# EAGLE design Bench_Controller (EAGLE 9.6.2)
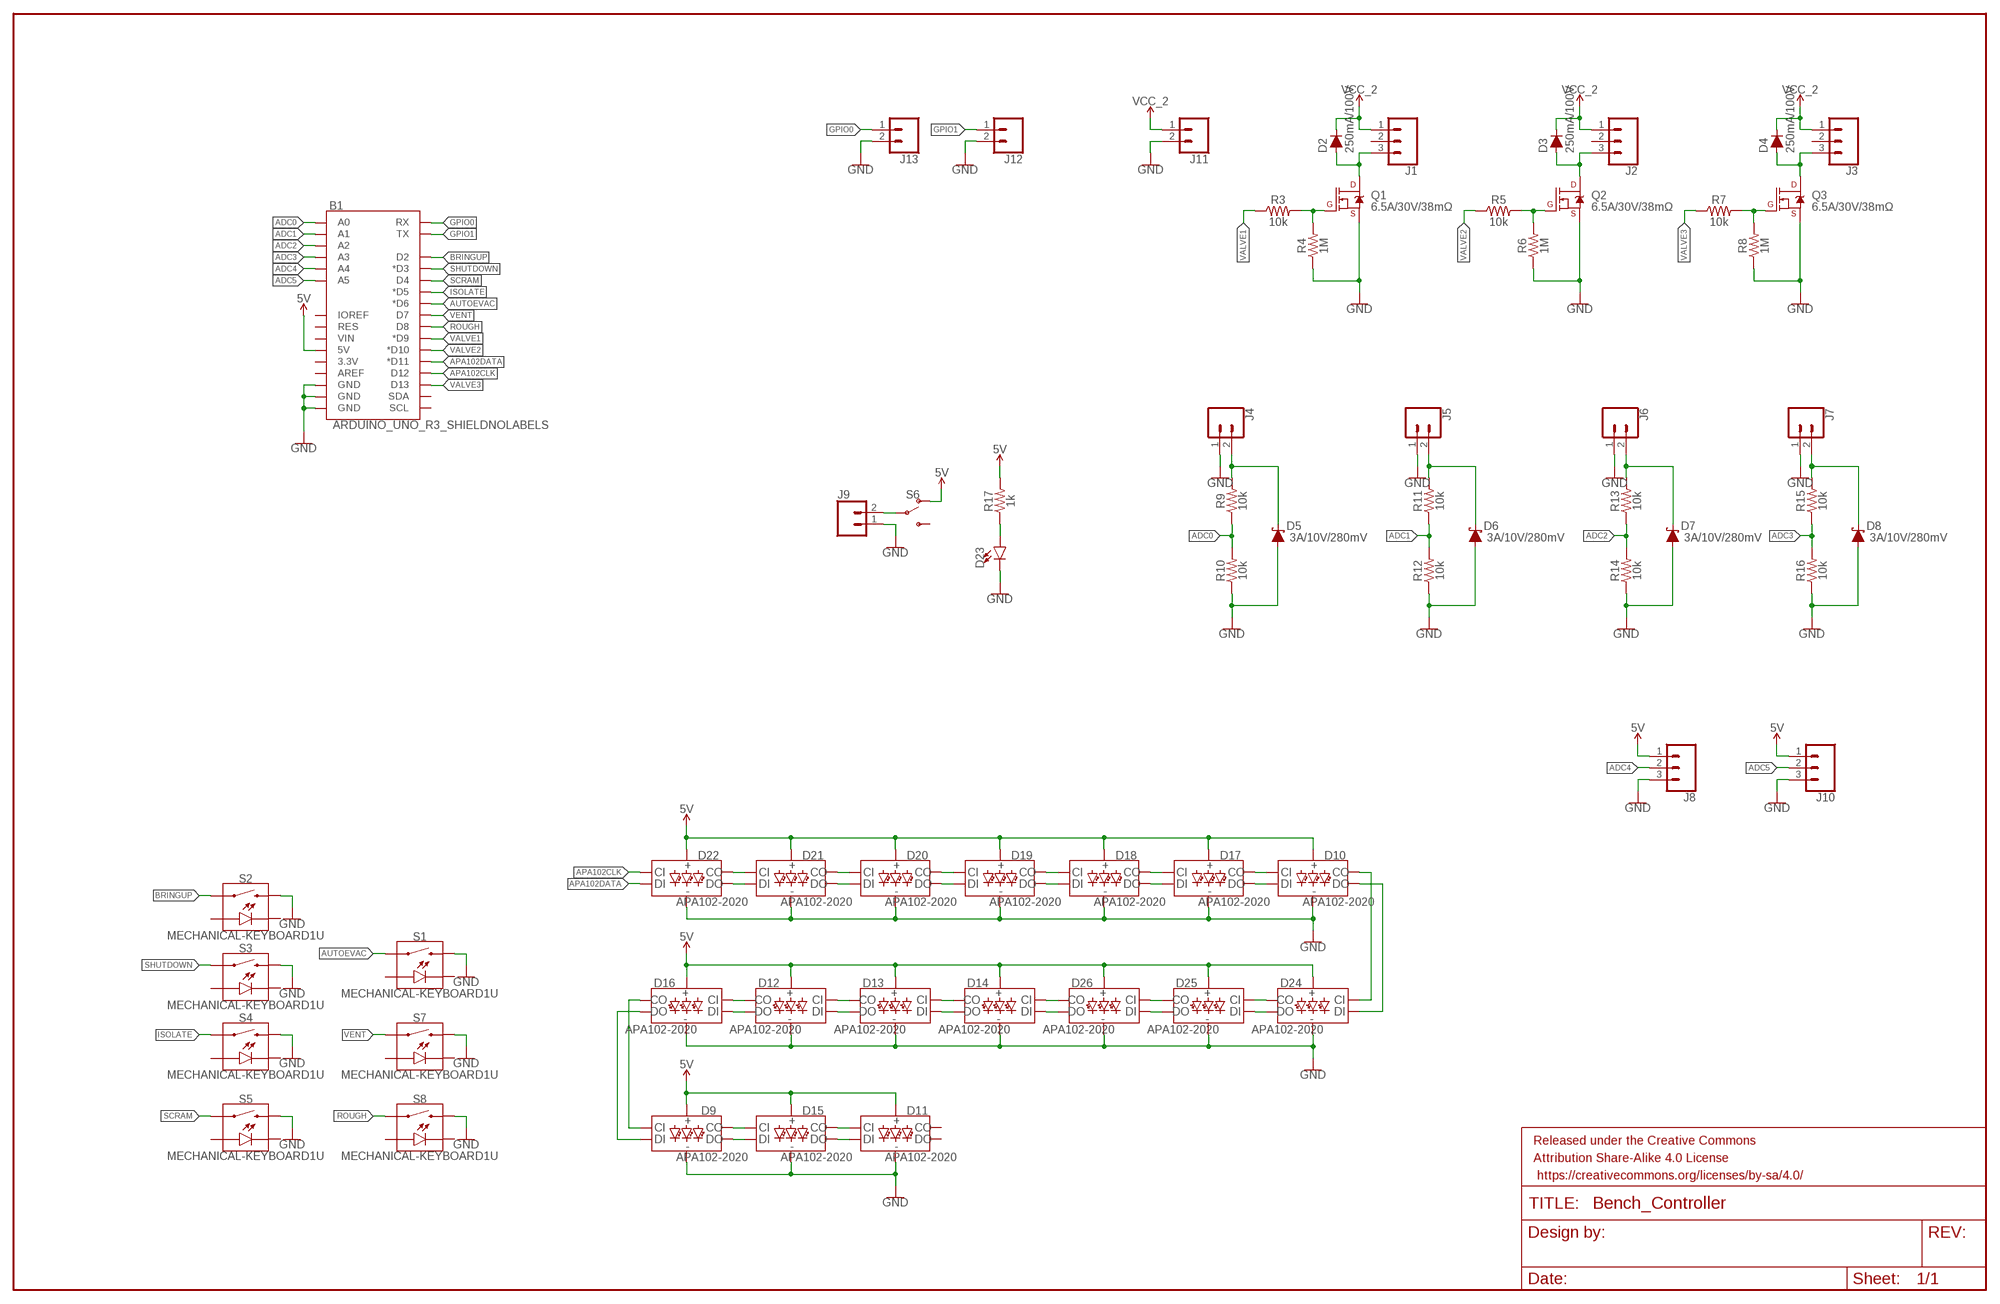
[diagram p0: schematic, sheet 1]

## Parts
B1  ARDUINO_UNO_R3_SHIELDNOLABELS  [UNO_R3_SHIELD_NOLABELS]
D2  250mA/100V  DIODE-BAS16J  [SOD-323]
D3  250mA/100V  DIODE-BAS16J  [SOD-323]
D4  250mA/100V  DIODE-BAS16J  [SOD-323]
D5  3A/10V/280mV  DIODE-SCHOTTKY-BAT60A  [SOD-323]
D6  3A/10V/280mV  DIODE-SCHOTTKY-BAT60A  [SOD-323]
D7  3A/10V/280mV  DIODE-SCHOTTKY-BAT60A  [SOD-323]
D8  3A/10V/280mV  DIODE-SCHOTTKY-BAT60A  [SOD-323]
D9  APA102-2020  [APA102-2020]
D10  APA102-2020  [APA102-2020]
D11  APA102-2020  [APA102-2020]
D12  APA102-2020  [APA102-2020]
D13  APA102-2020  [APA102-2020]
D14  APA102-2020  [APA102-2020]
D15  APA102-2020  [APA102-2020]
D16  APA102-2020  [APA102-2020]
D17  APA102-2020  [APA102-2020]
D18  APA102-2020  [APA102-2020]
D19  APA102-2020  [APA102-2020]
D20  APA102-2020  [APA102-2020]
D21  APA102-2020  [APA102-2020]
D22  APA102-2020  [APA102-2020]
D23  LED5MM  [LED_5MM]
D24  APA102-2020  [APA102-2020]
D25  APA102-2020  [APA102-2020]
D26  APA102-2020  [APA102-2020]
FRAME1  FRAME-LEDGER  [CREATIVE_COMMONS]
J1  CONN_031X03_NO_SILK  [1X03_NO_SILK]
J2  CONN_031X03_NO_SILK  [1X03_NO_SILK]
J3  CONN_031X03_NO_SILK  [1X03_NO_SILK]
J4  CONN_021X02_NO_SILK  [1X02_NO_SILK]
J5  CONN_021X02_NO_SILK  [1X02_NO_SILK]
J6  CONN_021X02_NO_SILK  [1X02_NO_SILK]
J7  CONN_021X02_NO_SILK  [1X02_NO_SILK]
J8  CONN_031X03_NO_SILK  [1X03_NO_SILK]
J9  CONN_021X02_NO_SILK  [1X02_NO_SILK]
J10  CONN_031X03_NO_SILK  [1X03_NO_SILK]
J11  CONN_021X02_NO_SILK  [1X02_NO_SILK]
J12  CONN_021X02_NO_SILK  [1X02_NO_SILK]
J13  CONN_021X02_NO_SILK  [1X02_NO_SILK]
Q1  6.5A/30V/38mΩ  MOSFET-NCH-FDS6630A  [SO08]
Q2  6.5A/30V/38mΩ  MOSFET-NCH-FDS6630A  [SO08]
Q3  6.5A/30V/38mΩ  MOSFET-NCH-FDS6630A  [SO08]
R3  10k  10KOHM-0603-1/10W-1%  [0603]
R4  1M  1MOHM-0603-1/4W-5%  [0603]
R5  10k  10KOHM-0603-1/10W-1%  [0603]
R6  1M  1MOHM-0603-1/4W-5%  [0603]
R7  10k  10KOHM-0603-1/10W-1%  [0603]
R8  1M  1MOHM-0603-1/4W-5%  [0603]
R9  10k  10KOHM-0603-1/10W-1%  [0603]
R10  10k  10KOHM-0603-1/10W-1%  [0603]
R11  10k  10KOHM-0603-1/10W-1%  [0603]
R12  10k  10KOHM-0603-1/10W-1%  [0603]
R13  10k  10KOHM-0603-1/10W-1%  [0603]
R14  10k  10KOHM-0603-1/10W-1%  [0603]
R15  10k  10KOHM-0603-1/10W-1%  [0603]
R16  10k  10KOHM-0603-1/10W-1%  [0603]
R17  1k  1KOHM-0603-1/10W-1%  [0603]
S1  MECHANICAL-KEYBOARD1U  [CHERRY-MX-LED-1U]
S2  MECHANICAL-KEYBOARD1U  [CHERRY-MX-LED-1U]
S3  MECHANICAL-KEYBOARD1U  [CHERRY-MX-LED-1U]
S4  MECHANICAL-KEYBOARD1U  [CHERRY-MX-LED-1U]
S5  MECHANICAL-KEYBOARD1U  [CHERRY-MX-LED-1U]
S6  SWITCH-SPDT-PTH-11.6X4.0MM  [SWITCH_SPDT_PTH_11.6X4.0MM]
S7  MECHANICAL-KEYBOARD1U  [CHERRY-MX-LED-1U]
S8  MECHANICAL-KEYBOARD1U  [CHERRY-MX-LED-1U]

## Nets
5V: B1.5V D9.VDD(VCC) D10.VDD(VCC) D11.VDD(VCC) D12.VDD(VCC) D13.VDD(VCC) D14.VDD(VCC) D15.VDD(VCC) D16.VDD(VCC) D17.VDD(VCC) D18.VDD(VCC) D19.VDD(VCC) D20.VDD(VCC) D21.VDD(VCC) D22.VDD(VCC) D24.VDD(VCC) D25.VDD(VCC) D26.VDD(VCC) J8.1 J10.1 R17.2 S6.1(O)
ADC0: B1.A0 R9.1 R10.2
ADC1: B1.A1 R11.1 R12.2
ADC2: B1.A2 R13.1 R14.2
ADC3: B1.A3 R15.1 R16.2
ADC4: B1.A4 J8.2
ADC5: B1.A5 J10.2
ANALOG_IN_0: D5.C J4.2 R9.2
ANALOG_IN_1: D6.C J5.2 R11.2
ANALOG_IN_2: D7.C J6.2 R13.2
ANALOG_IN_3: D8.C J7.2 R15.2
APA102CLK: B1.D12 D22.CKI(CI)
APA102DATA: B1.D11(*D11) D22.SDI(DI)
AUTOEVAC: B1.D6(*D6) S1.S1
BRINGUP: B1.D2 S2.S1
GND: B1.GND@0(GND) B1.GND@1(GND) B1.GND@2(GND) D5.A D6.A D7.A D8.A D9.GND D10.GND D11.GND D12.GND D13.GND D14.GND D15.GND D16.GND D17.GND D18.GND D19.GND D20.GND D21.GND D22.GND D23.K(C) D24.GND D25.GND D26.GND J4.1 J5.1 J6.1 J7.1 J8.3 J9.1 J10.3 J11.2 J12.2 J13.2 Q1.1(S) Q1.2(S) Q1.3(S) Q2.1(S) Q2.2(S) Q2.3(S) Q3.1(S) Q3.2(S) Q3.3(S) R4.1 R6.1 R8.1 R10.1 R12.1 R14.1 R16.1 S1.S2 S2.S2 S3.S2 S4.S2 S5.S2 S7.S2 S8.S2
GPIO0: B1.RX J13.1
GPIO1: B1.TX J12.1
ISOLATE: B1.D5(*D5) S4.S1
N$2: Q1.4(G) R3.2 R4.2
N$4: Q2.4(G) R5.2 R6.2
N$5: D2.A J1.3 Q1.5(D) Q1.6(D) Q1.7(D) Q1.8(D)
N$6: D3.A J2.3 Q2.5(D) Q2.6(D) Q2.7(D) Q2.8(D)
N$7: Q3.4(G) R7.2 R8.2
N$8: D4.A J3.3 Q3.5(D) Q3.6(D) Q3.7(D) Q3.8(D)
N$9: D21.CKI(CI) D22.CKO(CO)
N$10: J9.2 S6.2(P)
N$11: D23.A R17.1
N$12: D21.SDI(DI) D22.SDO(DO)
N$13: D20.CKI(CI) D21.CKO(CO)
N$14: D20.SDI(DI) D21.SDO(DO)
N$15: D19.CKI(CI) D20.CKO(CO)
N$16: D19.SDI(DI) D20.SDO(DO)
N$17: D18.CKI(CI) D19.CKO(CO)
N$18: D18.SDI(DI) D19.SDO(DO)
N$19: D17.CKI(CI) D18.CKO(CO)
N$20: D17.SDI(DI) D18.SDO(DO)
N$21: D10.CKI(CI) D17.CKO(CO)
N$22: D10.SDI(DI) D17.SDO(DO)
N$23: D10.CKO(CO) D24.CKI(CI)
N$25: D10.SDO(DO) D24.SDI(DI)
N$26: D24.CKO(CO) D25.CKI(CI)
N$27: D24.SDO(DO) D25.SDI(DI)
N$28: D25.CKO(CO) D26.CKI(CI)
N$29: D25.SDO(DO) D26.SDI(DI)
N$30: D14.CKI(CI) D26.CKO(CO)
N$31: D14.SDI(DI) D26.SDO(DO)
N$32: D13.CKI(CI) D14.CKO(CO)
N$33: D13.SDI(DI) D14.SDO(DO)
N$34: D12.CKI(CI) D13.CKO(CO)
N$35: D12.SDI(DI) D13.SDO(DO)
N$36: D12.CKO(CO) D16.CKI(CI)
N$37: D12.SDO(DO) D16.SDI(DI)
N$38: D9.CKI(CI) D16.CKO(CO)
N$39: D9.SDI(DI) D16.SDO(DO)
N$40: D9.CKO(CO) D15.CKI(CI)
N$41: D9.SDO(DO) D15.SDI(DI)
N$42: D11.CKI(CI) D15.CKO(CO)
N$43: D11.SDI(DI) D15.SDO(DO)
ROUGH: B1.D8 S8.S1
SCRAM: B1.D4 S5.S1
SHUTDOWN: B1.D3(*D3) S3.S1
VALVE1: B1.D9(*D9) R3.1
VALVE2: B1.D10(*D10) R5.1
VALVE3: B1.D13 R7.1
VCC_2: D2.C D3.C D4.C J1.1 J2.1 J3.1 J11.1
VENT: B1.D7 S7.S1
Unconnected: B1.3.3V B1.AREF B1.IOREF B1.RES B1.SCL B1.SDA B1.VIN D11.CKO(CO) D11.SDO(DO) J1.2 J2.2 J3.2 S1.A S1.K(C) S2.A S2.K(C) S3.A S3.K(C) S4.A S4.K(C) S5.A S5.K(C) S6.3(S) S7.A S7.K(C) S8.A S8.K(C)

## Library data of the parts
B1 = SparkFun-Boards:ARDUINO_UNO_R3_SHIELD: Arduino R3 Shield Footprint Shield form compatible with the Arduino Uno R3. SparkFun Products: MG2639 Cellular Shield <https://www.sparkfun.com/products/13120> MIDI Shield <https://www.sparkfun.com/products/12898> R3 Stackable Headers Kit <https://www.sparkfun.com/products/11417>
D2-D4 = SparkFun-DiscreteSemi:DIODE: Diode These are standard reverse protection diodes and small signal diodes. SparkFun Products: SparkFun SparkPunk Sound Kit <https://www.sparkfun.com/products/11177> SparkFun ESP8266 Thing <https://www.sparkfun.com/products/13231>; PROD_ID: DIO-09646
D5-D8 = SparkFun-DiscreteSemi:DIODE-SCHOTTKY: Schottky diode A Schottky diode is a semiconductor diode which has a low forward voltage drop and a very fast switching action.; PROD_ID: DIO-14072
D9-D22 D24-D26 = SparkFun-LED:APA102: Addressable RGB LED - 2 Wire Common names: APA102, Dotstar, etc. Packages: 5050 2020 SparkFun Products: SparkFun Lumenati Boards <https://www.sparkfun.com/categories/405>; PROD_ID: DIO-14111
D23 = SparkFun-LED:LED: LED (Generic) Standard schematic elements and footprints for 5mm, 3mm, 1206, and 0603 sized LEDs. Generic LEDs with no color specified.
FRAME1 = SparkFun-Aesthetics:FRAME-LEDGER: Schematic Frame - Ledger Standard 11x14 US Ledger frame
J1-J3 J8 J10 = SparkFun-Connectors:CONN_03: Multi connection point. Often used as Generic Header-pin footprint for 0.1 inch spaced/style header connections On any of the 0.1 inch spaced packages, you can populate with these: Break Away Headers - Straight <https://www.sparkfun.com/products/116> (PRT-00116) Break Away Male Headers - Right Angle <https://www.sparkfun.com/products/553> (PRT-00553) Female Headers <https://www.sparkfun.com/products/115> (PRT-00115) Break Away Headers - Machine Pin <https://www.sparkfun.com/products/117> (PRT-00117) Break Away Female Headers - Swiss Machine Pin <https://www.sparkfun.com/products/743> (PRT-00743) Stackable Header - 3 Pin (Female, 0.1") <https://www.sparkfun.com/products/13875> (PRT-13875) For SCREWTERMINALS and SPRING TERMINALS visit here: Screw Terimnals on SparkFun.com <https://www.sparkfun.com/search/results?term=Screw+Terminals> (5mm/3.5mm/2.54mm spacing) This device is also useful as a general connection point to wire up your design to another part of your project. Our various solder wires solder well into these plated through hole pads. Hook-Up Wire - Assortment (Stranded, 22 AWG) <https://www.sparkfun.com/products/11375> (PRT-11375) Hook-Up Wire - Assortment (Solid Core, 22 AWG) <https://www.sparkfun.com/products/11367> (PRT-11367) View the entire wire category on our website here <https://www.sparkfun.com/categories/141> Special notes: Molex polarized connector foot print use with SKU : PRT-08232 with associated crimp pins and housings.
J4-J7 J9 J11-J13 = SparkFun-Connectors:CONN_02: Multi connection point. Often used as Generic Header-pin footprint for 0.1 inch spaced/style header connections On any of the 0.1 inch spaced packages, you can populate with these: Break Away Headers - Straight <https://www.sparkfun.com/products/116> (PRT-00116) Break Away Male Headers - Right Angle <https://www.sparkfun.com/products/553> (PRT-00553) Female Headers <https://www.sparkfun.com/products/115> (PRT-00115) Break Away Headers - Machine Pin <https://www.sparkfun.com/products/117> (PRT-00117) Break Away Female Headers - Swiss Machine Pin <https://www.sparkfun.com/products/743> (PRT-00743) For SCREWTERMINALS and SPRING TERMINALS visit here: Screw Terimnals on SparkFun.com <https://www.sparkfun.com/search/results?term=Screw+Terminals> (5mm/3.5mm/2.54mm spacing) This device is also useful as a general connection point to wire up your design to another part of your project. Our various solder wires solder well into these plated through hole pads. Hook-Up Wire - Assortment (Stranded, 22 AWG) <https://www.sparkfun.com/products/11375> (PRT-11375) Hook-Up Wire - Assortment (Solid Core, 22 AWG) <https://www.sparkfun.com/products/11367> (PRT-11367) View the entire wire category on our website here <https://www.sparkfun.com/categories/141> Special notes: Molex polarized connector foot print use with: PRT-08233 with associated crimp pins and housings. 2.54_SCREWTERM for use with PRT-10571. 3.5mm Screw Terminal footprints for PRT-08084 5mm Screw Terminal footprints for use with PRT-08432
Q1-Q3 = SparkFun-DiscreteSemi:MOSFET-NCH: N-channel MOSFETs Voltage controlled devices that allow control of high current outputs. SparkFun Products: SparkFun OpenScale <https://www.sparkfun.com/products/13261> SparkFun Digital Sandbox <https://www.sparkfun.com/products/12651> SparkFun Monster Moto Shield <https://www.sparkfun.com/products/10182> SparkFun MOSFET Power Controller <https://www.sparkfun.com/products/11214>; PROD_ID: TRANS-08089
R3 R5 R7 R9-R16 = SparkFun-Resistors:10KOHM: 10kΩ resistor A resistor is a passive two-terminal electrical component that implements electrical resistance as a circuit element. Resistors act to reduce current flow, and, at the same time, act to lower voltage levels within circuits. - Wikipedia; PROD_ID: RES-00824
R4 R6 R8 = SparkFun-Resistors:1MOHM: 1MΩ resistor A resistor is a passive two-terminal electrical component that implements electrical resistance as a circuit element. Resistors act to reduce current flow, and, at the same time, act to lower voltage levels within circuits. - Wikipedia; PROD_ID: RES-07868
R17 = SparkFun-Resistors:1KOHM: 1kΩ resistor A resistor is a passive two-terminal electrical component that implements electrical resistance as a circuit element. Resistors act to reduce current flow, and, at the same time, act to lower voltage levels within circuits. - Wikipedia; PROD_ID: RES-07856
S1-S5 S7 S8 = SparkFun-Switches:MECHANICAL-KEYBOARD: Mechanical Keyboard Spacings for Cherry-MX Cherry-MX w/ LED switch footprints. Each package variant contains a bounding box on the tDocu layer for proper key spacing and a dimensional drawing on the Reference layer to be exported for laser cut mounting plates. Footprints are off-center so that the origin lies on the lower left corner of the key-spacing. This allows for most common layouts to be easily acheived on a grid spacing of 0.1875" Variants 1U through 1.75U in .25U steps Centered switch cutout in SwitchPlate layer with no stabilizers 2U through 2.75U in .25U steps Centered switch cutout in SwitchPlate layer with Cherry+Costar stabilizer holes 6.25U Common spacebar size Centered switch cutout in SwitchPlate layer with Cherry+Costar stabilizer holes "Big Ass" Enter ANSI 104 "Big Ass" Enter Key layout ISO Enter ISO style Enter Key layout
S6 = SparkFun-Switches:SWITCH-SPDT: Single Pole, Double Throw (SPDT) Switch Single-pole, double-throw (SPDT) switch. Variant Overview SMD-AYZ0202 Surface Mount DPDT Switch <https://www.sparkfun.com/products/597> (COM-00597) Used on e.g. LilyPad Arduino USB - ATmega32U4 Board <https://www.sparkfun.com/products/12049> PTH-11.6X4.0MM SPDT Mini Power Switch <https://www.sparkfun.com/products/102> (COM-00102) Used on e.g. SparkFun Simon Says - Through-Hole Soldering Kit <https://www.sparkfun.com/products/10547> (KIT-10547) PTH-11.6X4.0MM-KIT KIT version of SPDT Mini Power Switch - Simplifies soldering by removing tStop of switch pins - only one side can be soldered. PTH-11.6X4.0MM-LOCK LOCK version of SPDT Mini Power Switch - Offset pins hold switch in place for easier soldering. SMD-RIGHT-ANGLE Surface Mount Right Angle Switch <https://www.sparkfun.com/products/10860> (COM-10860) Used on e.g. SparkFun ESP8266 Thing <https://www.sparkfun.com/products/13231>; PROD_ID: SWCH-08261; SF_SKU: COM-00102

## Board
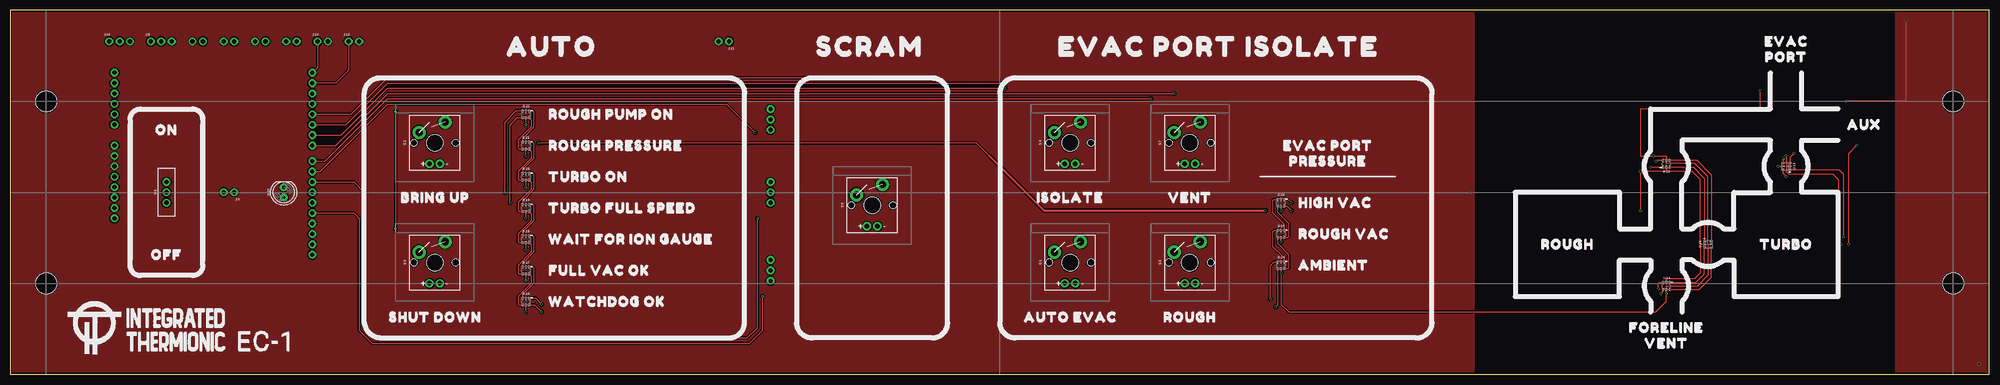
[diagram p1: board, top side]
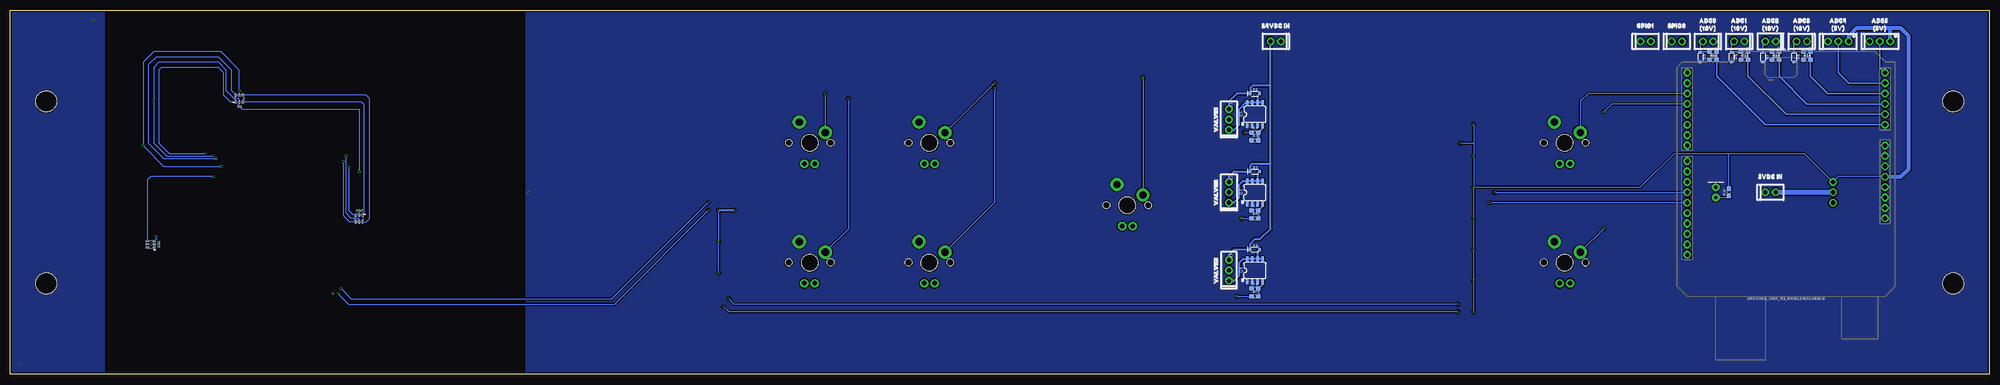
[diagram p2: board, bottom side, seen from below]

Size 482.6 x 88.9 mm. Coordinates in mm from the lower left corner, seen from the top.
Outline: 0,0 482.6,0 482.6,88.9 0,88.9 0,0
Copper layers (1*16): Top 0.035mm / dielectric 1.5mm / Bottom 0.035mm
Design rules "SparkFun-2-Layer-Minimum-JLCPCB": minimum track width 5mil, minimum drill 0.3mm, track to track 5mil, track to pad 5mil, pad to pad 5mil, via to via 5mil, smd to smd 5mil, copper to edge 7mil, drill to drill 7mil, minimum pad ring 5mil, minimum via ring 5mil, stop-mask expansion 4mil, vias tented up to drill 25mil, thermal gap 10mil
Holes 5.08 mm at 8.76,66.67 8.76,22.23 473.84,66.67 473.84,22.23

### Footprints (pad centres in the part's own frame; a part is rotated, then mirrored left to right if it is on the bottom)
UNO_R3_SHIELD_NOLABELS = drill 1.016 pad 1.88: 3.3V 24.13,-3.81; 5V 24.13,-1.27; A0 24.13,11.43; A1 24.13,13.97; A2 24.13,16.51; A3 24.13,19.05; A4 24.13,21.59; A5 24.13,24.13; AREF -24.13,-15.24; D2 -24.13,19.05; D3 -24.13,16.51; D4 -24.13,13.97; D5 -24.13,11.43; D6 -24.13,8.89; D7 -24.13,6.35; D8 -24.13,2.54; D9 -24.13,0; D10 -24.13,-2.54; D11 -24.13,-5.08; D12 -24.13,-7.62; D13 -24.13,-10.16; GND@0 24.13,1.27; GND@1 24.13,3.81; GND@2 -24.13,-12.7; IOREF 24.13,-8.89; NC 24.13,-11.43; RES 24.13,-6.35; RX -24.13,24.13; SCL -24.13,-20.32; SDA -24.13,-17.78; TX -24.13,21.59; VIN 24.13,6.35
SOD-323 = smd 0.63 x 0.83: A 1.15,0; C -1.15,0
APA102-2020 = smd 0.4 x 0.7: CKI -0.8,-0.85; CKO 0.8,-0.85; GND 0,0.85; SDI -0.8,0.85; SDO 0.8,0.85; VDD 0,-0.85
LED_5MM = drill 0.813 pad 1.88: A -1.27,0; K 1.27,0
1X03_NO_SILK = drill 1.016 pad 1.88: 1 0,0; 2 2.54,0; 3 5.08,0
1X02_NO_SILK = drill 1.016 pad 1.88: 1 0,0; 2 2.54,0
SO08 = smd 0.6 x 1.2: 1 -1.905,-2.8; 2 -0.635,-2.8; 3 0.635,-2.8; 4 1.905,-2.8; 5 1.905,2.8; 6 0.635,2.8; 7 -0.635,2.8; 8 -1.905,2.8
0603 = smd 1.1 x 1: 1 -0.85,0; 2 0.85,0
CHERRY-MX-LED-1U = drill 1.092 pad 2.032: A 8.255,4.445; K 10.795,4.445 | drill 1.753 pad 3.226: S1 5.715,12.065; S2 12.065,14.605 | hole 4.089: 9.525,9.525 | hole 1.707: 4.445,9.525; 14.605,9.525
SWITCH_SPDT_PTH_11.6X4.0MM = drill 1.016 pad 1.88: 1 0,2.54; 2 0,0; 3 0,-2.54

### Placement (x,y rotation side)
B1  49.53,49.53 0 bottom
D2  179.07,68.58 0 bottom
D3  179.07,49.53 0 bottom
D4  179.07,30.48 0 bottom
D5  70.48,77.47 270 bottom
D6  62.87,77.47 270 bottom
D7  55.24,77.47 270 bottom
D8  47.62,77.47 270 bottom
D9  426.72,67.31 180 bottom
D10  125.73,17.78 0 top
D11  448.31,31.75 270 bottom
D12  403.86,51.44 180 top
D13  414.02,31.75 90 top
D14  403.86,21.59 0 top
D15  433.07,50.8 270 top
D16  397.51,38.1 0 bottom
D17  125.73,25.4 0 top
D18  125.73,33.02 0 top
D19  125.73,40.64 0 top
D20  125.73,48.26 0 top
D21  125.73,55.88 0 top
D22  125.73,63.5 0 top
D23  66.67,44.45 90 top
D24  309.88,26.67 0 top
D25  309.88,34.29 0 top
D26  309.88,41.91 0 top
FRAME1  21.59,-8.89 0 top  (outside the outline)
J1  185.42,64.77 270 bottom
J2  185.42,46.99 270 bottom
J3  185.42,27.94 270 bottom
J4  67.31,81.28 180 bottom
J5  59.69,81.28 180 bottom
J6  52.07,81.28 180 bottom
J7  44.45,81.28 180 bottom
J8  34.29,81.28 0 top
J9  54.61,44.45 180 top
J10  24.13,81.28 0 top
J11  175.26,81.28 180 top
J12  82.55,81.28 0 top
J13  74.93,81.28 0 top
Q1  179.07,63.5 0 bottom
Q2  179.07,44.45 0 bottom
Q3  179.07,25.4 0 bottom
R3  179.07,59.05 0 bottom
R4  179.07,57.15 0 bottom
R5  179.07,38.1 0 bottom
R6  179.07,40.01 0 bottom
R7  179.07,19.05 0 bottom
R8  179.07,20.95 0 bottom
R9  67.31,78.74 180 bottom
R10  67.31,76.83 0 bottom
R11  59.69,78.74 180 bottom
R12  59.69,76.83 0 bottom
R13  52.07,78.74 180 bottom
R14  52.07,76.83 0 bottom
R15  44.45,78.74 180 bottom
R16  44.45,76.83 0 bottom
R17  63.5,44.45 90 bottom
S1  248.92,17.78 0 top
S2  93.98,46.99 0 top
S3  93.98,17.78 0 top
S4  248.92,46.99 0 top
S5  200.66,31.75 0 top
S6  38.1,44.45 0 top
S7  278.13,46.99 0 top
S8  278.13,17.78 0 top
U$1  [ROUGH0]  379.73,31.75 0 top
U$2  [TURBO0]  433.07,31.75 0 top
U$3  [FORELINE0]  403.86,11.43 0 top
U$4  [VENT0]  403.86,7.62 0 top
U$5  [EVAC0]  433.07,81.28 0 top
U$6  [PORT0]  433.07,77.47 0 top
U$7  [AUX0]  452.12,60.96 0 top
U$8  [ON0]  38.1,59.69 0 top
U$9  [OFF0]  38.1,29.21 0 top
U$10  [AUTO0]  132.08,80.01 0 top
U$11  [BRING_UP0]  103.63,43.18 0 top
U$12  [SHUT_DOWN0]  103.63,13.97 0 top
U$13  [SCRAM0]  209.55,80.01 0 top
U$14  [EVAC_PORT_ISOLATE0]  294.64,80.01 0 top
U$15  [FULL_VAC_OK0]  129.54,25.4 0 top
U$16  [ROUGH_PRESSURE0]  129.54,55.88 0 top
U$17  [TURBO_ON0]  129.54,48.26 0 top
U$18  [ROUGH_PUMP_ON0]  129.54,63.5 0 top
U$19  [TURBO_FULL_SPEED0]  129.54,40.64 0 top
U$20  [WATCHDOG_OK0]  129.54,17.78 0 top
U$21  [WAIT_FOR_ION_GAUGE0]  129.54,33.02 0 top
U$22  [ISOLATE0]  258.44,43.18 0 top
U$23  [AUTO_EVAC0]  258.57,13.97 0 top
U$24  [VENT0]  287.65,43.18 0 top
U$25  [ROUGH0]  287.65,13.97 0 top
U$26  [EVAC_PORT0]  321.31,55.88 0 top
U$27  [PRESSURE0]  321.31,52.07 0 top
U$28  [HIGH_VAC0]  312.42,41.91 0 top
U$29  [ROUGH_VAC0]  312.42,34.29 0 top
U$30  [AMBIENT0]  312.42,26.67 0 top
U$31  [ADC50]  26.67,86.36 0 bottom
U$32  [ADC40]  36.83,86.36 0 bottom
U$33  [ADC30]  45.72,86.36 0 bottom
U$34  [ADC20]  53.34,86.36 0 bottom
U$35  [ADC10]  60.96,86.36 0 bottom
U$36  [ADC00]  68.58,86.36 0 bottom
U$37  [GPIO00]  76.2,85.09 0 bottom
U$38  [GPIO10]  83.82,85.09 0 bottom
U$39  [5VDC_IN0]  53.34,48.26 0 bottom
U$40  [_##5V##_0]  26.67,84.45 0 bottom
U$41  [_##5V##_0]  36.83,84.45 0 bottom
U$42  [_##10V##_0]  45.72,84.45 0 bottom
U$43  [_##10V##_0]  53.34,84.45 0 bottom
U$44  [_##10V##_0]  60.96,84.45 0 bottom
U$45  [_##10V##_0]  68.58,84.45 0 bottom
U$46  [24VDC_IN0]  173.99,85.09 0 bottom
U$47  [VALVE10]  188.59,62.23 90 bottom
U$48  [VALVE20]  188.59,44.45 90 bottom
U$49  [VALVE30]  188.59,25.4 90 bottom
U$50  [INTEG#SVG0]  -40.01,43.18 0 top  (outside the outline)
U$51  [EC#10]  51.69,8.13 0 top

### Tracks (layer width: path | path; a pad name or v marks a point on that pad's centre or on a via)
5V  (via drill 0.3, 0.35, 0.38)
  Top 0.203: D22.VDD v125.73,60.96 | v125.73,53.34 D21.VDD | D20.VDD v125.73,45.72 | D19.VDD v125.73,38.1 | D18.VDD v125.73,30.48 | D17.VDD v125.73,22.86 | D10.VDD v125.73,15.24 | D26.VDD v309.88,40.01 | v309.88,32.38 D25.VDD | D24.VDD v309.88,24.77 309.88,17.14 311.79,15.24 401.32,15.24 403.86,17.78 v403.86,19.68 D14.VDD 403.86,21.59 411.48,21.59 414.02,24.13 414.02,31.75 | D13.VDD 414.02,31.75 | 414.02,31.75 414.02,48.26 410.85,51.44 403.86,51.44 D12.VDD 403.86,53.34 v400.69,53.34 397.51,53.34 397.51,64.77 426.08,64.77 426.72,65.41 v426.72,69.22 | v431.17,50.8 D15.VDD | v448.31,31.75 448.31,53.98 v450.21,55.88 | 238.76,53.34 235.59,56.52 v128.91,56.52
  Top 0.508: 238.76,53.34 252.09,40.01 v306.07,40.01
  Bottom 0.203: v125.73,60.96 125.73,56.52 | 125.73,56.52 v125.73,53.34 v125.73,45.72 | v125.73,45.72 v125.73,38.1 v125.73,30.48 v125.73,22.86 v125.73,15.24 | v309.88,40.01 v309.88,32.38 v309.88,24.77 | D9.VDD v426.72,69.22 426.72,74.3 431.17,78.74 447.68,78.74 450.21,76.2 v450.21,55.88 445.13,50.8 v431.17,50.8 | D11.VDD v448.31,31.75 | D16.VDD 397.51,38.1 399.42,38.1 400.69,39.37 v400.69,53.34 | v128.91,56.52 125.73,56.52 | v125.73,45.72 85.09,45.72 76.83,53.98 63.5,53.98 | 63.5,53.98 45.09,53.98 S6.1 36.83,48.26 B1.5V | R17.2 63.5,53.98
  Bottom 0.508: v306.07,40.01 v309.88,40.01
  Bottom 1.016: B1.5V 21.59,48.26 19.68,50.16 19.68,82.55 21.59,84.45 24.13,84.45 | 24.13,84.45 32.38,84.45 34.29,82.55 J8.1 | J10.1 24.13,84.45
ADC0
  Bottom 0.406: R9.1 R10.2 66.46,72.81 54.61,60.96 B1.A0
ADC1
  Bottom 0.406: R11.1 R12.2 58.84,72.81 49.53,63.5 B1.A1
ADC2
  Bottom 0.406: R13.1 R14.2 51.22,72.81 44.45,66.04 B1.A2
ADC3
  Bottom 0.406: R15.1 R16.2 43.6,72.81 39.37,68.58 B1.A3
ADC4
  Bottom 0.406: J8.2 36.83,73.66 34.29,71.12 B1.A4
ADC5
  Bottom 0.406: J10.2 26.67,74.93 B1.A5
ANALOG_IN_0
  Bottom 0.406: R9.2 70.36,78.74 D5.C 70.48,80.64 J4.2
ANALOG_IN_1
  Bottom 0.406: J5.2 62.87,80.64 D6.C 62.74,78.74 R11.2
ANALOG_IN_2
  Bottom 0.406: J6.2 55.24,80.64 D7.C 55.12,78.74 R13.2
ANALOG_IN_3
  Bottom 0.406: J7.2 47.62,80.64 D8.C 47.51,78.74 R15.2
APA102CLK  (via drill 0.35)
  Top 0.203: v121.92,41.91 121.92,60.91 123.66,62.65 D22.CKI
  Bottom 0.203: v121.92,41.91 B1.D12
APA102DATA  (via drill 0.35)
  Top 0.203: v120.65,44.45 120.65,61.59 123.41,64.35 D22.SDI
  Bottom 0.203: v120.65,44.45 B1.D11
AUTOEVAC  (via drill 0.35)
  Top 0.203: B1.D6 80.64,58.42 92.08,69.85 v242.57,69.85
  Bottom 0.203: v242.57,69.85 242.57,41.91 S1.S1
BRINGUP
  Bottom 0.203: B1.D2 97.79,68.58 99.69,66.67 S2.S1
GND  (via drill 0.35, 0.38)
  Top 0.203: D14.GND 403.86,23.5 410.85,23.5 412.12,24.77 412.12,31.75 | v433.07,53.34 433.07,50.8 | D15.GND 433.07,50.8 | v462.28,86.36 462.28,66.67 v447.68,66.67 | 433.07,50.8 433.07,49.53 433.7,48.9 444.5,48.9 445.77,47.62 445.77,32.38 v446.4,31.75 | D12.GND 403.86,49.53 | D13.GND 412.12,31.75 | 412.12,31.75 412.12,47.62 410.21,49.53 403.86,49.53 | 403.86,49.53 v397.51,49.53 397.51,44.45 | 397.51,44.45 v397.51,40.01 | v356.24,44.45 397.51,44.45
  Bottom 0.203: v433.07,53.34 444.5,53.34 447.68,56.52 v447.68,66.67 447.68,74.93 446.4,76.2 431.8,76.2 429.89,74.3 429.89,69.22 427.99,67.31 426.72,67.31 D9.GND 426.72,65.41 426.08,64.77 397.51,64.77 v397.51,49.53 | v446.4,31.75 D11.GND | v397.51,40.01 D16.GND
  other vias: 480.06,2.54
  pour Top (isolate 0.305): 0,88.9 356.87,88.9 356.87,0 0,0
  pour Bottom (isolate 0.305): 0,88.9 356.87,88.9 356.87,0 0,0
  pour Bottom (isolate 0.305): 482.6,88.9 459.74,88.9 459.74,0 482.6,0
  pour Top (isolate 0.305): 482.6,88.9 459.74,88.9 459.74,0 482.6,0
GPIO0
  Top 0.203: J13.1 74.93,74.93 B1.RX
GPIO1
  Top 0.203: J12.1 82.55,74.3 79.38,71.12 B1.TX
ISOLATE  (via drill 0.35)
  Top 0.203: B1.D5 81.92,60.96 92.08,71.12 v242.57,71.12
  Bottom 0.203: S4.S1 v242.57,71.12
N$2
  Bottom 0.508: Q1.4 177.16,60.11 R3.2 R4.2
N$4
  Bottom 0.508: Q2.4 177.16,41.06 R6.2 R5.2
N$5
  Bottom 0.508: D2.A 178.44,68.06 Q1.6 | Q1.5 Q1.6 | Q1.6 Q1.7 Q1.8 181.35,66.3 182.88,64.77 182.88,60.96 184.15,59.69 J1.3
N$6
  Bottom 0.508: D3.A 178.44,49.02 Q2.6 | Q2.5 Q2.6 | Q2.6 Q2.7 Q2.8 181.99,47.25 182.88,46.35 182.88,43.18 184.15,41.91 J2.3
N$7
  Bottom 0.508: Q3.4 177.16,22.01 R8.2 R7.2
N$8
  Bottom 0.508: D4.A 178.44,29.96 Q3.6 | Q3.5 Q3.6 | Q3.6 Q3.7 Q3.8 181.99,28.2 182.88,27.3 182.88,24.13 184.15,22.86 J3.3
N$9
  Top 0.203: D22.CKO 127,62.18 127,60.33 123.83,57.15 123.83,55.24 124.04,55.03 D21.CKI
N$10
  Bottom 1.27: S6.2 J9.2
N$11
  Bottom 0.203: D23.A 63.92,43.18 R17.1
N$12
  Top 0.203: D22.SDO 127.42,64.35 127.64,64.14 127.64,60.33 124.93,57.62 D21.SDI
N$13
  Top 0.203: D21.CKO 127,54.56 127,52.7 123.83,49.53 123.83,47.62 124.04,47.41 D20.CKI
N$14
  Top 0.203: D21.SDO 127.42,56.73 127.64,56.52 127.64,52.7 124.93,50 D20.SDI
N$15
  Top 0.203: D20.CKO 127,46.94 127,45.09 123.83,41.91 123.83,40.01 124.04,39.79 D19.CKI
N$16
  Top 0.203: D20.SDO 127.42,49.11 127.64,48.9 127.64,45.09 124.93,42.38 D19.SDI
N$17
  Top 0.203: D19.CKO 127,39.32 127,37.47 123.83,34.29 123.83,32.38 124.04,32.17 D18.CKI
N$18
  Top 0.203: D19.SDO 127.42,41.49 127.64,41.27 127.64,37.47 124.93,34.76 D18.SDI
N$19
  Top 0.203: D18.CKO 127,31.7 127,29.84 123.83,26.67 123.83,24.77 124.04,24.55 D17.CKI
N$20
  Top 0.203: D18.SDO 127.42,33.87 127.64,33.66 127.64,29.84 124.93,27.14 D17.SDI
N$21
  Top 0.203: D17.CKO 127,24.08 127,22.23 123.83,19.05 123.83,17.14 124.04,16.93 D10.CKI
N$22
  Top 0.203: D17.SDO 127.42,26.25 127.64,26.04 127.64,22.23 124.93,19.52 D10.SDI
N$23  (via drill 0.35)
  Top 0.203: D10.CKO 127.85,16.93 v129.54,15.24 | v308.61,16.51 309.08,16.98 D24.CKI
  Bottom 0.203: v129.54,15.24 307.34,15.24 v308.61,16.51
N$25  (via drill 0.35)
  Top 0.203: D10.SDO 128.06,18.63 v129.54,17.14 | v307.34,18.41 307.34,26.67 308.19,27.52 D24.SDI
  Bottom 0.203: v129.54,17.14 306.07,17.14 v307.34,18.41
N$26
  Top 0.203: D24.CKO 311.57,25.82 311.79,26.04 311.79,29.21 309.08,31.91 D25.CKI
N$27
  Top 0.203: D24.SDO 310.68,28.41 307.98,31.11 307.98,34.92 308.19,35.14 D25.SDI
N$28
  Top 0.203: D25.CKO 311.57,33.44 311.79,33.66 311.79,36.83 309.08,39.53 D26.CKI
N$29
  Top 0.203: D25.SDO 310.68,36.66 307.98,39.37 307.98,42.55 308.19,42.76 D26.SDI
N$30  (via drill 0.35)
  Top 0.203: D26.CKO 311.37,41.06 v312.42,40.01 | v402.59,19.68 403.06,20.16 D14.CKI
  Bottom 0.203: v312.42,40.01 335.28,17.14 400.05,17.14 v402.59,19.68
N$31  (via drill 0.35)
  Top 0.203: D26.SDO 311.57,42.76 v312.42,41.91 | v401.95,20.95 401.95,22.23 402.17,22.44 D14.SDI
  Bottom 0.203: v312.42,41.91 335.92,18.41 399.42,18.41 v401.95,20.95
N$32
  Top 0.203: D14.CKO 411.9,20.74 414.87,23.71 D13.CKI
N$33
  Top 0.203: D14.SDO 411.06,22.44 413.17,24.55 D13.SDI
N$34
  Top 0.203: D13.CKO 414.87,48.68 411.26,52.28 D12.CKI
N$35
  Top 0.203: D13.SDO 413.17,47.84 410.43,50.59 D12.SDI
N$36  (via drill 0.38)
  Top 0.203: v401.32,52.07 401.54,52.28 D12.CKO
  Bottom 0.203: D16.CKI 399.83,37.25 401.32,38.73 v401.32,52.07
N$37  (via drill 0.38)
  Top 0.203: v400.05,50.55 400.09,50.59 D12.SDO
  Bottom 0.203: D16.SDI 399,38.95 400.05,40.01 v400.05,50.55
N$38
  Bottom 0.203: D9.CKI 395.82,68.16 394.97,67.31 394.97,38.1 395.82,37.25 D16.CKO
N$39
  Bottom 0.203: D9.SDI 396.88,66.46 396.24,65.83 396.24,39.37 396.66,38.95 D16.SDO
N$40  (via drill 0.38)
  Top 0.203: v432.44,52.7 432.22,52.49 D15.CKI
  Bottom 0.203: D9.CKO 428.62,69.27 428.62,74.3 431.8,77.47 447.04,77.47 448.94,75.56 448.94,56.52 445.13,52.7 v432.44,52.7
N$41  (via drill 0.38)
  Top 0.203: v434.98,53.98 433.92,52.92 D15.SDI
  Bottom 0.203: D9.SDO 428.79,66.46 430.53,68.2 430.53,73.66 431.8,74.93 445.77,74.93 446.4,74.3 446.4,56.52 443.87,53.98 v434.98,53.98
N$42  (via drill 0.38)
  Top 0.203: D15.CKO 432.22,49.11 v433.07,48.26
  Bottom 0.203: v433.07,48.26 448.31,48.26 449.16,47.41 D11.CKI
N$43  (via drill 0.38)
  Top 0.203: D15.SDO 445.94,50 447.04,48.9 v447.04,33.66
  Bottom 0.203: v447.04,33.66 447.04,32.97 D11.SDI
ROUGH  (via drill 0.35)
  Top 0.203: B1.D8 76.83,52.07 92.08,67.31 v278.13,67.31
  Bottom 0.203: v278.13,67.31 278.13,35.56 S8.S1
SCRAM  (via drill 0.35)
  Top 0.203: B1.D4 83.19,63.5 92.08,72.39 v206.38,72.39
  Bottom 0.203: v206.38,72.39 S5.S1
SHUTDOWN  (via drill 0.35)
  Top 0.203: v93.98,64.14 v93.98,35.56
  Bottom 0.203: B1.D3 92.08,66.04 v93.98,64.14 | v93.98,35.56 S3.S1
VALVE1  (via drill 0.35)
  Top 0.203: B1.D9 75.56,49.53 92.08,66.04 174.62,66.04 v181.61,59.05
  Bottom 0.203: v181.61,59.05 R3.1
VALVE2  (via drill 0.35)
  Top 0.203: B1.D10 83.82,46.99 86.36,44.45 86.36,11.43 88.9,8.89 179.71,8.89 182.25,11.43 v182.25,38.1
  Bottom 0.203: v182.25,38.1 R5.1
VALVE3  (via drill 0.35)
  Top 0.203: B1.D13 83.82,39.37 85.09,38.1 85.09,10.79 88.27,7.62 180.34,7.62 183.51,10.79 v183.51,19.05
  Bottom 0.203: v183.51,19.05 R7.1
VCC_2
  Bottom 0.508: J1.1 185.42,66.67 183.51,68.58 D2.C 180.22,69.97 179.71,70.48 175.26,70.48 | J2.1 185.42,48.26 184.15,49.53 D3.C 180.22,50.92 179.71,51.44 175.26,51.44 | J3.1 185.42,29.21 184.15,30.48 D4.C 180.22,31.87 179.07,33.02 177.8,33.02 175.26,35.56 175.26,51.44 | 175.26,51.44 175.26,70.48 | 175.26,70.48 J11.1
VENT  (via drill 0.35)
  Top 0.203: B1.D7 79.38,55.88 92.08,68.58 v283.85,68.58
  Bottom 0.203: v283.85,68.58 S7.S1